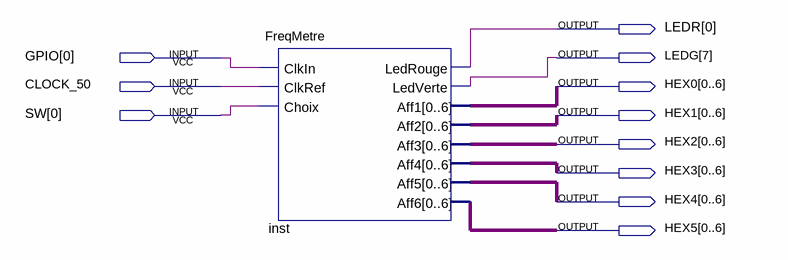
[diagram p0: schematic sheet]
// Quartus schematic FreqMetreSchema.bdf as structural Verilog: 1 symbols, 11 pins
module FreqMetreSchema (
  input  [0:0] GPIO,
  input  CLOCK_50,
  input  [0:0] SW,
  output [0:0] LEDR,
  output [7:7] LEDG,
  output [0:6] HEX0,
  output [0:6] HEX1,
  output [0:6] HEX2,
  output [0:6] HEX3,
  output [0:6] HEX4,
  output [0:6] HEX5
);

  FreqMetre inst (
    .ClkIn(GPIO[0]), .ClkRef(CLOCK_50), .Choix(SW[0]), .LedRouge(LEDR[0]), .LedVerte(LEDG[7]), .Aff1(HEX0),
    .Aff2(HEX1), .Aff3(HEX2), .Aff4(HEX3), .Aff5(HEX4), .Aff6(HEX5));
endmodule
